# Altium project 2.4GHandShank.PrjPcb
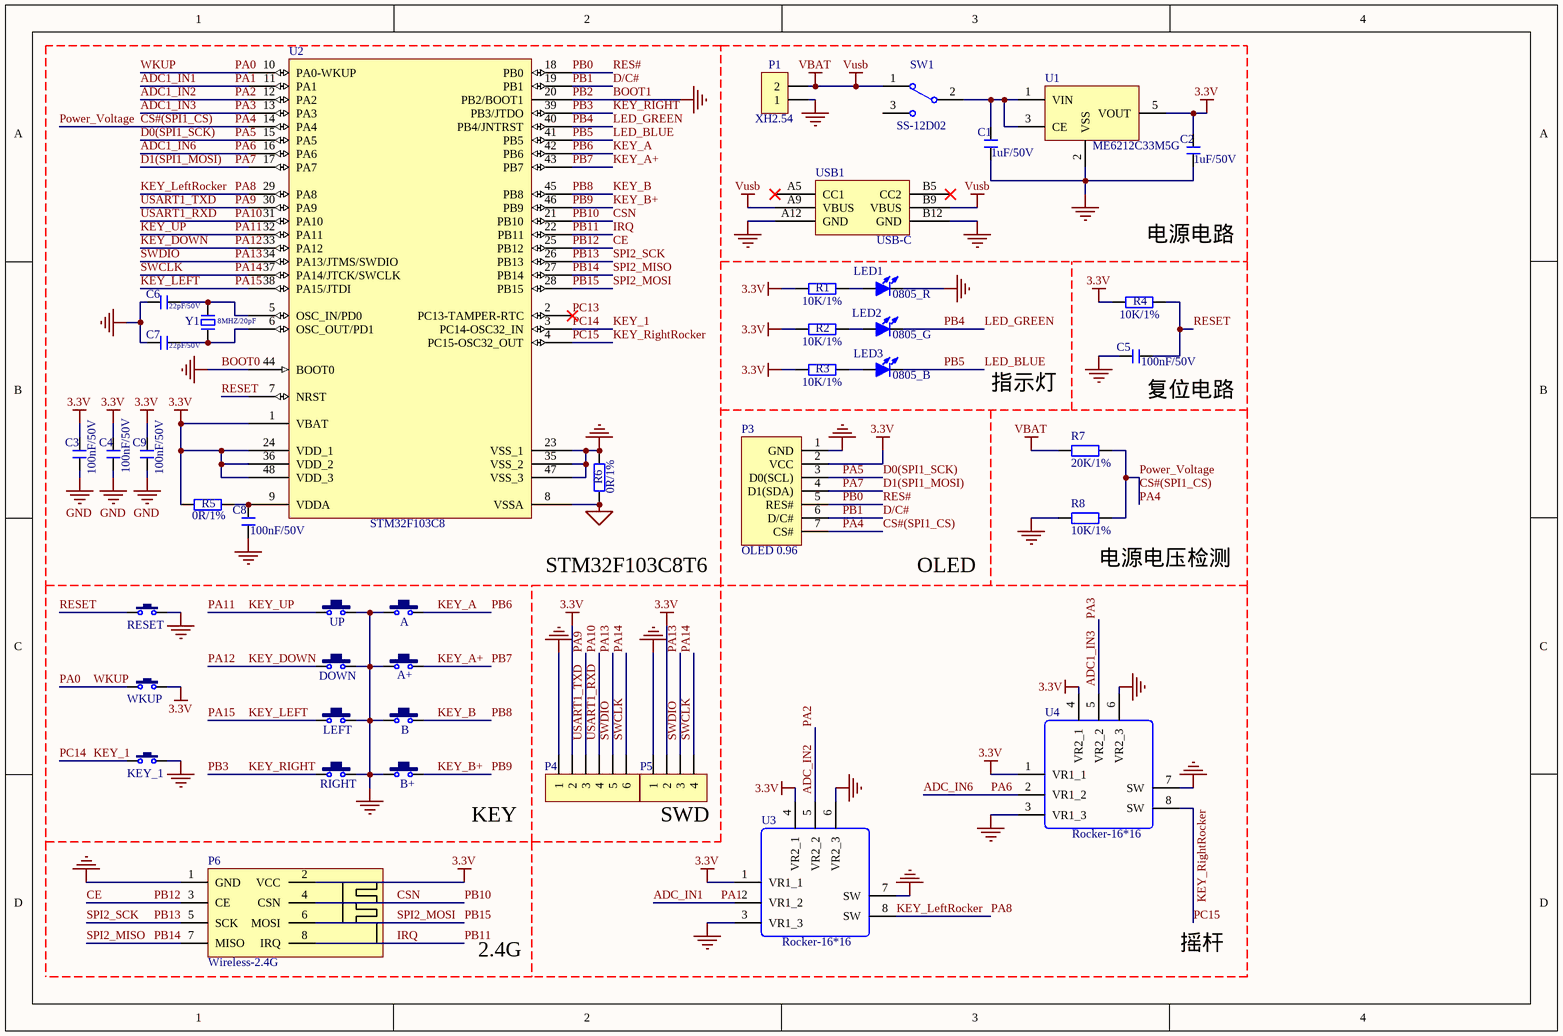
[diagram p0: 原理图_2.4GHandShank.SchDoc]
1 sheet, 43 parts. Net scope: global (net labels, ports and power ports of the same name join across sheets).
Board file: PCB_2.4GHandShank.PcbDoc

## Sheet 原理图_2.4GHandShank.SchDoc
size A4; SheetNumber: 1; SheetTotal: 1

### Parts
A  6x6x5  [KEY-6*6*8]  (value not drawn)
A+  6x6x5  [KEY-6*6*8]  (value not drawn)
B  6x6x5  [KEY-6*6*8]  (value not drawn)
B+  6x6x5  [KEY-6*6*8]  (value not drawn)
C1  1uF/50V  [C 0603_M]
C2  1uF/50V  [C 0603_M]
C3  100nF/50V  [C 0603_M]
C4  100nF/50V  [C 0603_M]
C5  100nF/50V  [C 0603_M]
C6  22pF/50V  [C 0603_M]
C7  22pF/50V  [C 0603_M]
C8  100nF/50V  [C 0603_M]
C9  100nF/50V  [C 0603_M]
DOWN  6x6x5  [KEY-6*6*8]  (value not drawn)
KEY_1  3x6x5  [TSW SMD-3*6*2.5]  (value not drawn)
LED1  0805_R  [LED 0805R]
LED2  0805_G  [LED 0805G]
LED3  0805_B  [LED 0805B]
LEFT  6x6x5  [KEY-6*6*8]  (value not drawn)
P1  XH2.54  [XH2.54-WI-2P]
P3  OLED 0.96  [OLED 0.96]
P4  HDR-1X6  [HDR2.54-M-LI-6P]  (value not drawn)
P5  HDR-1X4  [HDR2.54-LI-4P]  (value not drawn)
P6  Wireless-2.4G  [Wireless-2.4G]
R1  10K/1%  [R 0603_M]
R2  10K/1%  [R 0603_M]
R3  10K/1%  [R 0603_M]
R4  10K/1%  [R 0603_M]
R5  0R/1%  [R 0603_M]
R6  0R/1%  [R 0603_M]
R7  20K/1%  [R 0603_M]
R8  10K/1%  [R 0603_M]
RESET  3x6x5  [TSW SMD-3*6*2.5]  (value not drawn)
RIGHT  6x6x5  [KEY-6*6*8]  (value not drawn)
SW1  SS-12D02  [SS-12D02]
U1  ME6212C33M5G  [SOT23-5M]
U2  STM32F103C8  [LQFP48 7X7_M]
U3  Rocker-16*16  [Rocker]
U4  Rocker-16*16  [Rocker]
UP  6x6x5  [KEY-6*6*8]  (value not drawn)
USB1  USB-C  [USB-C-SMD_6P]
WKUP  3x6x5  [TSW SMD-3*6*2.5]  (value not drawn)
Y1  8MHZ/20pF  [OSC HC-49S]

### Blocks framed on the sheet
STM32F103C8T6: C3 C4 C6-C9 R5 R6 U2 Y1

### Nets
3.3V: C2.2 C3.2 C4.2 C9.2 P3.2(VCC) P4.2 P5.2 P6.2(VCC) R1.2 R2.2 R3.2 R4.2 R5.1 U1.5(VOUT) U2.1(VBAT) U2.24(VDD_1) U2.36(VDD_2) U2.48(VDD_3) U3.1(VR1_1) U3.4(VR2_1) U4.1(VR1_1) U4.4(VR2_1) WKUP.2
AGND: R6.1 U2.8(VSSA)
BOOT0: A.1 A+.1 B.1 B+.1 C1.1 C2.1 C3.1 C4.1 C5.1 C6.1 C7.1 C8.1 C9.1 DOWN.1 KEY_1.2 LED1.2(K) LEFT.1 P1.1 P3.1(GND) P4.1 P5.1 P6.1(GND) R6.2 R8.1 RESET.2 RIGHT.1 U1.2(VSS) U2.20(PB2/BOOT1) U2.23(VSS_1) U2.35(VSS_2) U2.44(BOOT0) U2.47(VSS_3) U3.3(VR1_3) U3.6(VR2_3) U3.7(SW) U4.3(VR1_3) U4.6(VR2_3) U4.7(SW) UP.1 USB1.A12(GND) USB1.B12(GND)  [also labelled BOOT1, GND, PB2]
VBAT: P1.2 R7.1 SW1.1 USB1.A9(VBUS) USB1.B9(VBUS)  [also labelled Vusb]
ADC1_IN1: U2.11(PA1) U3.2(VR1_2)  [also labelled ADC_IN1, PA1]
ADC1_IN2: U2.12(PA2) U3.5(VR2_2)  [also labelled ADC_IN2, PA2]
ADC1_IN3: U2.13(PA3) U4.5(VR2_2)  [also labelled PA3]
ADC1_IN6: U2.16(PA6) U4.2(VR1_2)  [also labelled ADC_IN6, PA6]
CE: P6.3(CE) U2.25(PB12)  [also labelled PB12]
CS#(SPI1_CS): P3.7(CS#) R7.2 R8.2 U2.14(PA4)  [also labelled PA4, Power_Voltage]
CSN: P6.4(CSN) U2.21(PB10)  [also labelled PB10]
D0(SPI1_SCK): P3.3(D0(SCL)) U2.15(PA5)  [also labelled PA5]
D1(SPI1_MOSI): P3.4(D1(SDA)) U2.17(PA7)  [also labelled PA7]
D/C#: P3.6(D/C#) U2.19(PB1)  [also labelled PB1]
IRQ: P6.8(IRQ) U2.22(PB11)  [also labelled PB11]
KEY_1: KEY_1.1 U2.3(PC14-OSC32_IN)  [also labelled PC14]
KEY_A: A.2 U2.42(PB6)  [also labelled PB6]
KEY_A+: A+.2 U2.43(PB7)  [also labelled PB7]
KEY_B: B.2 U2.45(PB8)  [also labelled PB8]
KEY_B+: B+.2 U2.46(PB9)  [also labelled PB9]
KEY_DOWN: DOWN.2 U2.33(PA12)  [also labelled PA12]
KEY_LEFT: LEFT.2 U2.38(PA15/JTDI)  [also labelled PA15]
KEY_LeftRocker: U2.29(PA8) U3.8(SW)  [also labelled PA8]
KEY_RIGHT: RIGHT.2 U2.39(PB3/JTDO)  [also labelled PB3]
KEY_RightRocker: U2.4(PC15-OSC32_OUT) U4.8(SW)  [also labelled PC15]
KEY_UP: U2.32(PA11) UP.2  [also labelled PA11]
LED_BLUE: LED3.2(K) U2.41(PB5)  [also labelled PB5]
LED_GREEN: LED2.2(K) U2.40(PB4/JNTRST)  [also labelled PB4]
PA0: U2.10(PA0-WKUP) WKUP.1  [also labelled WKUP]
PA9: P4.3 U2.30(PA9)  [also labelled USART1_TXD]
PA10: P4.4 U2.31(PA10)  [also labelled USART1_RXD]
PA13: P4.5 P5.3 U2.34(PA13/JTMS/SWDIO)  [also labelled SWDIO]
PA14: P4.6 P5.4 U2.37(PA14/JTCK/SWCLK)  [also labelled SWCLK]
PB0: P3.5(RES#) U2.18(PB0)  [also labelled RES#]
PB13: P6.5(SCK) U2.26(PB13)  [also labelled SPI2_SCK]
PB14: P6.7(MISO) U2.27(PB14)  [also labelled SPI2_MISO]
PB15: P6.6(MOSI) U2.28(PB15)  [also labelled SPI2_MOSI]
PC13: U2.2(PC13-TAMPER-RTC)
RESET: C5.2 R4.1 RESET.1 U2.7(NRST)
NetC1_2: C1.2 SW1.2 U1.1(VIN) U1.3(CE)
NetC6_2: C6.2 U2.5(OSC_IN/PD0) Y1.2
NetC7_2: C7.2 U2.6(OSC_OUT/PD1) Y1.1
NetC8_2: C8.2 R5.2 U2.9(VDDA)
NetLED1_1: LED1.1(A) R1.1
NetLED2_1: LED2.1(A) R2.1
NetLED3_1: LED3.1(A) R3.1

Not connected (* = marked no-connect by the designer): SW1 3; USB1 A5(CC1)* B5(CC2)*

### Notes on the sheet
- 电源电路
- 指示灯
- (near C5) 复位电路
- OLED
- (near R8) 电源电压检测
- KEY
- SWD
- 2.4G
- 摇杆

### Library data of the parts
A A+ B B+ DOWN LEFT RIGHT UP = TSW DIP-6x6: 直插6x6轻触开关; 版权归属: 源创客; BOM名称: 直插6x6轻触开关; 学习资源: www.ooocke.com
C1-C9 = C: 无极性贴片电容; 版权归属: 源创客; BOM名称: 无极性贴片电容; 学习资源: www.ooocke.com
KEY_1 RESET WKUP = TSW 3x6: 3x6轻触开关; 版权归属: 源创客; BOM名称: 3x6轻触开关; 学习资源: www.ooocke.com
LED1-LED3 = LED-SMD: 贴片LED; 版权归属: 源创客; BOM名称: 贴片LED; 学习资源: www.ooocke.com
P1 = Header 2: 2P接插件; 版权归属: 源创客; BOM名称: 2P接插件; 学习资源: www.ooocke.com
P3 = OLED 0.96: BOM名称: 12864 点阵屏; 版权归属: 源创客; 学习资源: www.ooocke.com
P4 = Header 6: 6P接插件; 版权归属: 源创客; BOM名称: 6P接插件; 学习资源: www.ooocke.com
P5 = Header 4: 4P接插件; 版权归属: 源创客; BOM名称: 4P接插件; 学习资源: www.ooocke.com
P6 = Wireless-2.4G: 2.4GWiFI模块
R1-R8 = R: 贴片电阻; 版权归属: 源创客; BOM名称: 贴片电阻; 学习资源: www.ooocke.com
SW1 = SSW-1P: 1路波动开关; BOM名称: 波动开关; 版权归属: 源创客; 学习资源: www.ooocke.com
U1 = ME6212C33M5G: 低压差线性稳压器
U2 = STM32F103C8: Flaah:64/RAM:20/IO:36; BOM名称: 32位STM单片机; 版权归属: 源创客; 学习资源: www.ooocke.com
U3 U4 = Rocker: 摇杆16*16
USB1 = USB-C 6P: USB-C型母接口 6Pin; 版权归属: 源创客; BOM名称: USB-C型母接口; 学习资源: www.ooocke.com
Y1 = XTAL-2P: 2脚无源脚晶振; 版权归属: 源创客; BOM名称: 2脚无源脚晶振; 学习资源: www.ooocke.com